# EAGLE design display_temp (EAGLE 5.02)
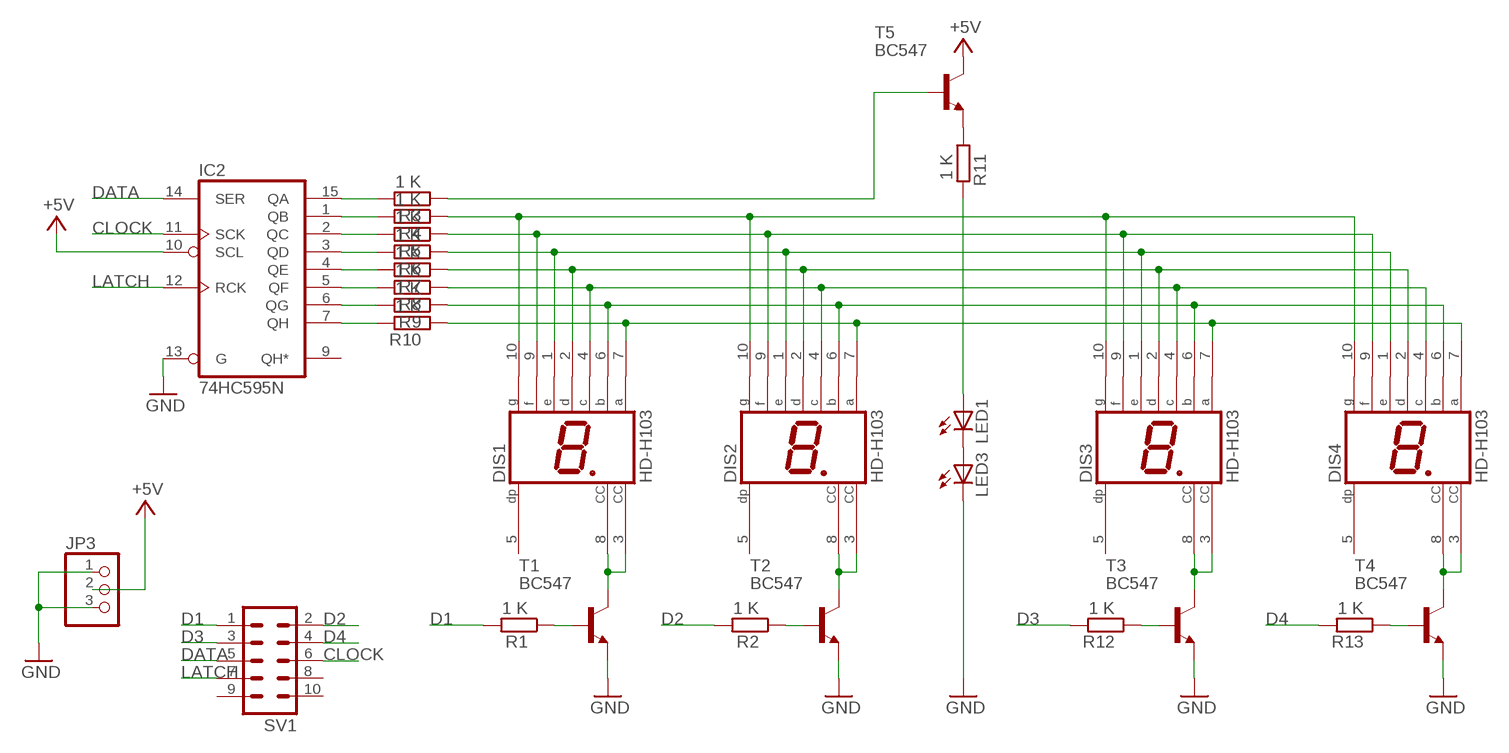
[diagram p0: schematic, sheet 1]

## Parts
DIS1  HD-H103  [HDSP-M]
DIS2  HD-H103  [HDSP-M]
DIS3  HD-H103  [HDSP-M]
DIS4  HD-H103  [HDSP-M]
IC2  74HC595N  [DIL16]
JP3  PINHD-1X3180  [1X03]
LED1  LED3MM  [LED3MM]
LED3  LED3MM  [LED3MM]
R1  1 K  R-EU_0207/10  [0207/10]
R2  1 K  R-EU_0207/10  [0207/10]
R3  1 K  R-EU_0207/10  [0207/10]
R4  1 K  R-EU_0207/10  [0207/10]
R5  1 K  R-EU_0207/10  [0207/10]
R6  1 K  R-EU_0207/10  [0207/10]
R7  1 K  R-EU_0207/10  [0207/10]
R8  1 K  R-EU_0207/10  [0207/10]
R9  1 K  R-EU_0207/10  [0207/10]
R10  1 K  R-EU_0207/10  [0207/10]
R11  1 K  R-EU_0207/10  [0207/10]
R12  1 K  R-EU_0207/10  [0207/10]
R13  1 K  R-EU_0207/10  [0207/10]
SV1  ML10  [ML10]
T1  BC547  [TO92]
T2  BC547  [TO92]
T3  BC547  [TO92]
T4  BC547  [TO92]
T5  BC547  [TO92]

## Nets
+5V: IC2.10(SCL) JP3.2 T5.3(C)
CLOCK: IC2.11(SCK) SV1.6
D1: R1.2 SV1.1
D2: R2.2 SV1.2
D3: R12.2 SV1.3
D4: R13.2 SV1.4
DATA: IC2.14(SER) SV1.5
GND: IC2.13(G) JP3.1 JP3.3 LED3.K(C) T1.1(E) T2.1(E) T3.1(E) T4.1(E)
LATCH: IC2.12(RCK) SV1.7
N$1: DIS1.3(CC) DIS1.8(CC) T1.3(C)
N$2: DIS1.9(F) DIS2.9(F) DIS3.9(F) DIS4.9(F) R5.1
N$3: R1.1 T1.2(B)
N$4: DIS1.1(E) DIS2.1(E) DIS3.1(E) DIS4.1(E) R6.1
N$5: DIS1.10(G) DIS2.10(G) DIS3.10(G) DIS4.10(G) R4.1
N$6: DIS1.4(C) DIS2.4(C) DIS3.4(C) DIS4.4(C) R8.1
N$7: DIS1.7(A) DIS2.7(A) DIS3.7(A) DIS4.7(A) R10.1
N$8: IC2.2(QC) R5.2
N$9: R3.1 T5.2(B)
N$10: DIS2.3(CC) DIS2.8(CC) T2.3(C)
N$11: R2.1 T2.2(B)
N$12: R11.1 T5.1(E)
N$13: LED1.A R11.2
N$14: DIS1.2(D) DIS2.2(D) DIS3.2(D) DIS4.2(D) R7.1
N$15: LED1.K(C) LED3.A
N$16: DIS3.3(CC) DIS3.8(CC) T3.3(C)
N$17: DIS1.6(B) DIS2.6(B) DIS3.6(B) DIS4.6(B) R9.1
N$18: R12.1 T3.2(B)
N$19: IC2.4(QE) R7.2
N$20: IC2.5(QF) R8.2
N$21: IC2.6(QG) R9.2
N$22: IC2.7(QH) R10.2
N$23: IC2.3(QD) R6.2
N$24: IC2.1(QB) R4.2
N$25: IC2.15(QA) R3.2
N$26: DIS4.3(CC) DIS4.8(CC) T4.3(C)
N$27: R13.1 T4.2(B)
Unconnected: DIS1.5(DP) DIS2.5(DP) DIS3.5(DP) DIS4.5(DP) IC2.9(QH*) SV1.8 SV1.9 SV1.10

## Power pins joined to a net without a drawn wire
GND: IC2.8(GND)
VCC: IC2.16(VCC)

## Library data of the parts
DIS1-DIS4 = display:HD-H103: LED DISPLAY 1-character 7 segment, decimal point right
IC2 = display:74*595: 8-bit SHIFT REGISTER, output latch
JP3 = display:PINHD-1X3: PIN HEADER
LED1 LED3 = display:LED: LED OSRAM: - CHIPLED LG R971, LG N971, LY N971, LG Q971, LY Q971, LO R971, LY R971 LH N974, LH R974 LS Q976, LO Q976, LY Q976 LO Q996 - Hyper CHIPLED LW Q18S LB Q993, LB Q99A, LB R99A - SideLED LS A670, LO A670, LY A670, LG A670, LP A670 LB A673, LV A673, LT A673, LW A673 LH A674 LY A675 LS A676, LA A676, LO A676, LY A676, LW A676 LS A679, LY A679, LG A679 - Hyper Micro SIDELED® LS Y876, LA Y876, LO Y876, LY Y876 LT Y87S - SmartLED LW L88C, LW L88S LB L89C, LB L89S, LG L890 LS L89K, LO L89K, LY L89K LS L896, LA L896, LO L896, LY L896 - TOPLED LS T670, LO T670, LY T670, LG T670, LP T670 LSG T670, LSP T670, LSY T670, LOP T670, LYG T670 LG T671, LOG T671, LSG T671 LB T673, LV T673, LT T673, LW T673 LH T674 LS T676, LA T676, LO T676, LY T676, LB T676, LH T676, LSB T676, LW T676 LB T67C, LV T67C, LT T67C, LS T67K, LO T67K, LY T67K, LW E67C LS E67B, LA E67B, LO E67B, LY E67B, LB E67C, LV E67C, LT E67C LW T67C LS T679, LY T679, LG T679 LS T770, LO T770, LY T770, LG T770, LP T770 LB T773, LV T773, LT T773, LW T773 LH T774 LS E675, LA E675, LY E675, LS T675 LS T776, LA T776, LO T776, LY T776, LB T776 LHGB T686 LT T68C, LB T68C - Hyper Mini TOPLED® LB M676 - Mini TOPLED Santana® LG M470 LS M47K, LO M47K, LY M47K Source: http://www.osram.convergy.de - LUMILED® LXK2-PW12-R00, LXK2-PW12-S00, LXK2-PW14-U00, LXK2-PW14-V00 LXK2-PM12-R00, LXK2-PM12-S00, LXK2-PM14-U00 LXK2-PE12-Q00, LXK2-PE12-R00, LXK2-PE12-S00, LXK2-PE14-T00, LXK2-PE14-U00 LXK2-PB12-K00, LXK2-PB12-L00, LXK2-PB12-M00, LXK2-PB14-N00, LXK2-PB14-P00, LXK2-PB14-Q00 LXK2-PR12-L00, LXK2-PR12-M00, LXK2-PR14-Q00, LXK2-PR14-R00 LXK2-PD12-Q00, LXK2-PD12-R00, LXK2-PD12-S00 LXK2-PH12-R00, LXK2-PH12-S00 LXK2-PL12-P00, LXK2-PL12-Q00, LXK2-PL12-R00 Source: www.luxeon.com
R1-R13 = display:R-EU_: RESISTOR, European symbol
SV1 = display:ML10: HARTING
T1-T5 = display:BC547: NPN TRANSISTOR

## Board
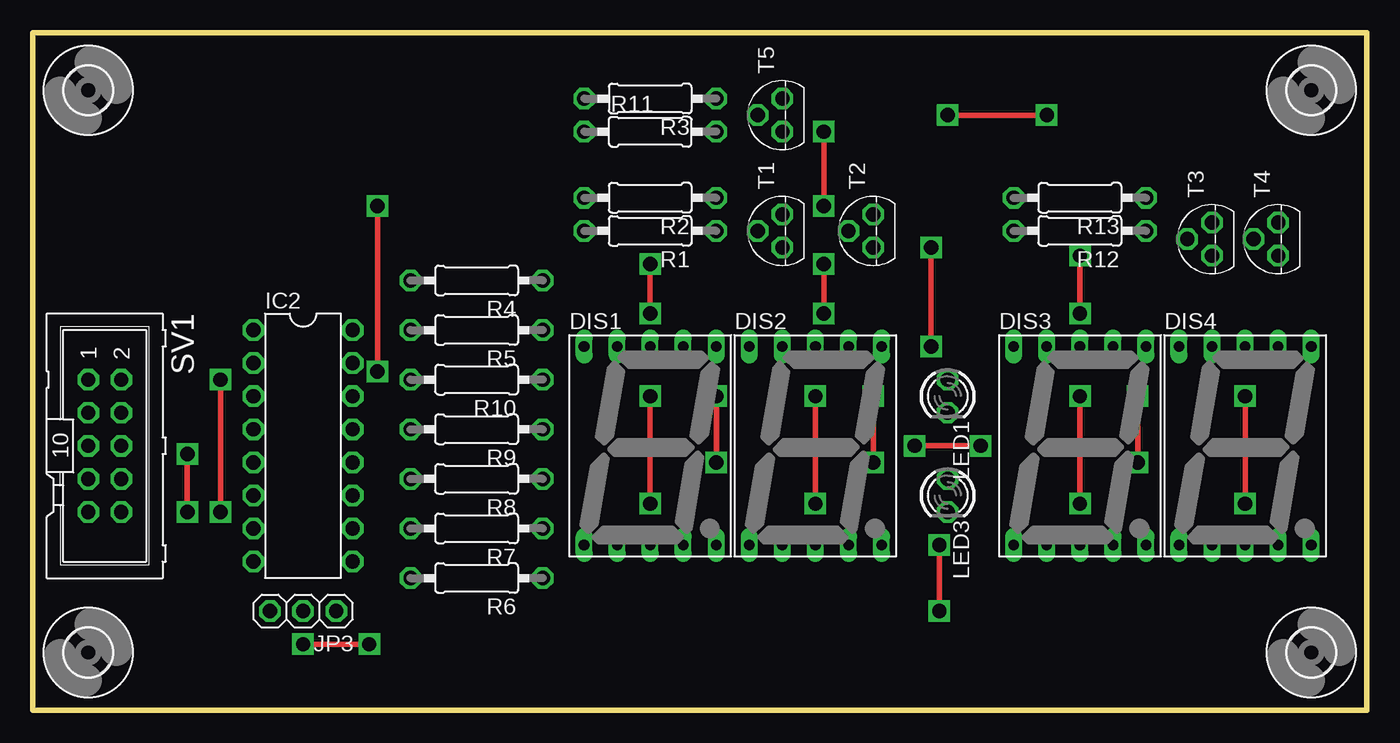
[diagram p1: board, top side]
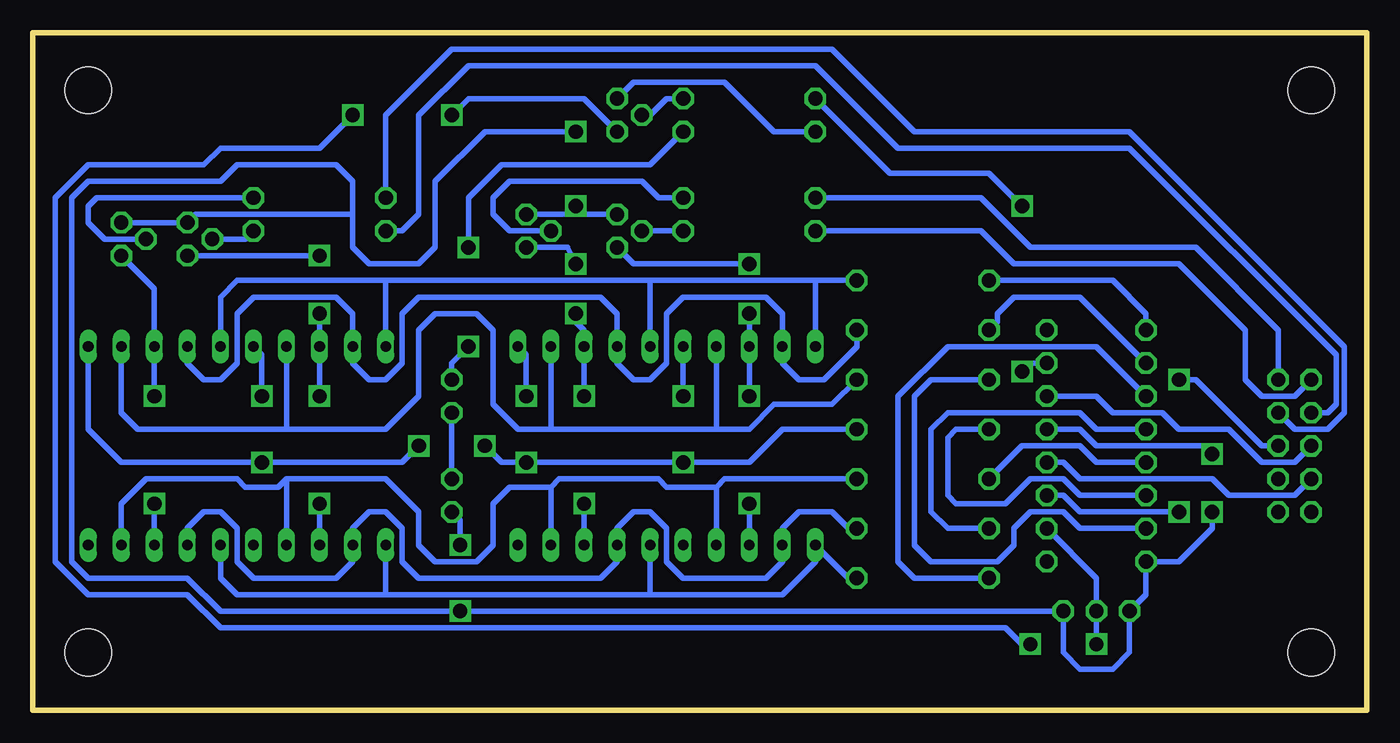
[diagram p2: board, bottom side, seen from below]

Size 102.54 x 52.06 mm. Coordinates in mm from the lower left corner, seen from the top.
Outline: 0,0 102.54,0 102.54,52.06 0,52.06 0,0
Copper layers (1*16): Top 0.035mm / dielectric 1.5mm / Bottom 0.035mm
Design rules "default": minimum track width 10mil, minimum drill 24mil, track to track 8mil, track to pad 8mil, pad to pad 8mil, via to via 8mil, smd to smd 8mil, copper to edge 40mil, drill to drill 8mil, minimum pad ring 10mil, minimum via ring 8mil, stop-mask expansion 4mil, vias tented up to drill 0mil, thermal gap 10mil

### Footprints (pad centres in the part's own frame; a part is rotated, then mirrored left to right if it is on the bottom)
HDSP-M = drill 0.813 long: 1 -5.08,-7.62; 2 -2.54,-7.62; 3 0,-7.62; 4 2.54,-7.62; 5 5.08,-7.62; 6 5.08,7.62; 7 2.54,7.62; 8 0,7.62; 9 -2.54,7.62; 10 -5.08,7.62
DIL16 = drill 1.1 octagon: 1 -8.89,-3.81; 2 -6.35,-3.81; 3 -3.81,-3.81; 4 -1.27,-3.81; 5 1.27,-3.81; 6 3.81,-3.81; 7 6.35,-3.81; 8 8.89,-3.81; 9 8.89,3.81; 10 6.35,3.81; 11 3.81,3.81; 12 1.27,3.81; 13 -1.27,3.81; 14 -3.81,3.81; 15 -6.35,3.81; 16 -8.89,3.81
1X03 = drill 1.1 octagon: 1 -2.54,0; 2 0,0; 3 2.54,0
LED3MM = drill 1.1 octagon: A -1.27,0; K 1.27,0
0207/10 = drill 1.1 octagon: 1 -5.08,0; 2 5.08,0
ML10 = drill 1.1 octagon: 1 -5.08,-1.27; 2 -5.08,1.27; 3 -2.54,-1.27; 4 -2.54,1.27; 5 0,-1.27; 6 0,1.27; 7 2.54,-1.27; 8 2.54,1.27; 9 5.08,-1.27; 10 5.08,1.27
TO92 = drill 1.1 octagon: 1 1.27,0; 2 0,1.905; 3 -1.27,0
3,6 = hole 3.6: 0,0

### Placement (x,y rotation side)
DIS1  47.46,20.31 0 top
DIS2  60.16,20.31 0 top
DIS3  80.48,20.31 0 top
DIS4  93.18,20.31 0 top
IC2  20.79,20.31 270 top
JP3  20.79,7.62 180 top
LED1  70.32,24.12 270 top
LED3  70.32,16.51 270 top
R1  47.46,36.83 180 top
R2  47.46,39.37 180 top
R3  47.46,46.98 180 top
R4  34.12,33.02 180 top
R5  34.12,29.2 180 top
R6  34.12,10.16 180 top
R7  34.12,13.97 180 top
R8  34.12,17.77 180 top
R9  34.12,21.59 180 top
R10  34.12,25.4 180 top
R11  47.46,44.45 0 top
R12  80.48,36.83 180 top
R13  80.48,39.37 180 top
SV1  5.55,20.31 270 top
T1  57.62,36.83 90 top
T2  64.6,36.83 90 top
T3  90.64,36.19 90 top
T4  95.72,36.19 90 top
T5  57.62,45.72 90 top
U$1  [3,6]  4.28,4.44 0 top
U$2  [3,6]  4.28,47.62 0 top
U$3  [3,6]  98.26,47.62 0 top
U$4  [3,6]  98.26,4.44 0 top

### Tracks (layer width: path | path; a pad name or v marks a point on that pad's centre or on a via)
+5V  (via drill 1.1)
  Top 0.406: v77.94,45.72 v70.32,45.72 | v20.79,5.08 v25.87,5.08
  Bottom 0.406: IC2.10 20.79,10.16 JP3.2 v20.79,5.08 | T5.3 60.16,46.98 69.05,46.98 v70.32,45.72 | v77.94,45.72 80.48,43.17 88.1,43.17 89.37,41.91 98.26,41.91 100.8,39.37 100.8,11.43 98.26,8.89 90.64,8.89 88.1,6.35 27.77,6.35 26.5,5.08 v25.87,5.08
CLOCK  (via drill 1.1)
  Top 0.406: v14.44,25.4 v14.44,15.23
  Bottom 0.406: IC2.11 23.33,16.51 22.06,15.23 v14.44,15.23 | v14.44,25.4 13.17,25.4 8.09,20.31 SV1.6
D1
  Bottom 0.406: SV1.1 5.55,24.12 8.09,24.12 9.36,25.4 9.36,29.2 14.44,34.29 27.14,34.29 29.68,36.83 R1.2
D2
  Bottom 0.406: SV1.2 6.82,29.2 13.17,35.55 25.87,35.55 29.68,39.37 R2.2
D3
  Bottom 0.406: R12.2 74.13,36.83 72.86,38.09 72.86,45.72 69.05,49.53 42.38,49.53 36.03,43.17 18.25,43.17 2.38,27.3 2.38,23.49 3.01,22.86 SV1.3
D4
  Bottom 0.406: SV1.4 5.55,21.59 3.01,21.59 1.74,22.86 1.74,27.94 18.25,44.45 34.76,44.45 41.11,50.8 70.32,50.8 75.4,45.72 R13.2
DATA
  Bottom 0.406: SV1.5 5.55,19.05 8.09,19.05 10.63,21.59 14.44,21.59 15.71,22.86 19.52,22.86 20.79,24.12 IC2.14
GND  (via drill 1.1)
  Top 0.406: v69.69,7.62 v69.69,12.7 | v11.9,15.23 v11.9,19.68 | v60.8,44.45 v60.8,38.73
  Bottom 0.406: T4.1 T3.1 90,38.09 77.94,38.09 | IC2.13 22.06,21.59 20.79,20.31 12.54,20.31 v11.9,19.68 | v11.9,15.23 11.9,13.97 14.44,11.43 IC2.8 16.98,8.89 JP3.3 18.25,4.44 19.52,3.17 22.06,3.17 23.33,4.44 JP3.1 v69.69,7.62 88.1,7.62 90.64,10.16 98.26,10.16 99.53,11.43 99.53,39.37 98.26,40.63 88.1,40.63 86.83,41.91 79.21,41.91 77.94,40.63 77.94,38.09 | 60.8,38.09 T1.1 | 60.8,38.09 T2.1 | v60.8,44.45 67.78,44.45 71.59,40.63 71.59,35.55 72.86,34.29 76.67,34.29 77.94,35.55 77.94,38.09 | v60.8,38.73 60.8,38.09 | v69.69,12.7 69.69,14.6 LED3.K
LATCH
  Bottom 0.406: IC2.12 23.33,19.05 22.06,17.77 11.9,17.77 10.63,16.51 5.55,16.51 SV1.7
N$1  (via drill 1.1)
  Top 0.406: v47.46,15.87 v47.46,24.12 | v47.46,30.48 v47.46,34.29
  Bottom 0.406: DIS1.3 v47.46,15.87 | v47.46,24.12 DIS1.8 v47.46,30.48 | T1.3 56.35,34.29 v47.46,34.29
N$2
  Bottom 0.406: DIS4.9 90.64,26.66 89.37,25.4 88.1,25.4 86.83,26.66 86.83,30.48 85.56,31.75 79.21,31.75 77.94,30.48 DIS3.9 77.94,26.66 76.67,25.4 75.4,25.4 74.13,26.66 74.13,30.48 72.86,31.75 58.89,31.75 57.62,30.48 DIS2.9 57.62,26.66 56.35,25.4 55.08,25.4 53.81,26.66 53.81,30.48 52.54,31.75 46.19,31.75 44.92,30.48 DIS1.9 44.92,26.66 43.65,25.4 41.75,25.4 39.2,27.94 R5.1
N$3
  Bottom 0.406: R1.1 T1.2
N$4
  Bottom 0.406: 55.08,10.16 DIS2.1 55.08,8.89 | 55.08,8.89 75.4,8.89 | 75.4,8.89 DIS3.1 | 55.08,8.89 44.92,8.89 42.38,11.43 DIS1.1 39.84,10.16 R6.1 | 75.4,8.89 86.83,8.89 88.1,10.16 DIS4.1
N$5
  Bottom 0.406: 55.08,30.48 DIS2.10 55.08,33.02 | 55.08,33.02 75.4,33.02 | 75.4,33.02 DIS3.10 | 75.4,33.02 86.83,33.02 88.1,31.75 DIS4.10 | 42.38,33.02 R4.1 | DIS1.10 42.38,33.02 | 42.38,33.02 55.08,33.02
N$6
  Bottom 0.406: 83.02,17.77 DIS3.4 | DIS4.4 95.72,15.87 93.81,17.77 86.83,17.77 86.19,17.14 83.66,17.14 83.02,17.77 | 62.7,17.14 DIS2.4 | 50,17.14 DIS1.4 | 47.46,17.77 49.36,17.77 50,17.14 | 47.46,17.77 46.83,17.77 | 62.7,17.14 62.06,17.77 54.44,17.77 53.81,17.14 50,17.14 | 83.02,17.77 75.4,17.77 72.86,15.23 72.86,12.7 71.59,11.43 68.41,11.43 67.14,12.7 67.14,15.87 65.88,17.14 62.7,17.14 | R8.1 47.46,17.77
N$7
  Bottom 0.406: 50,21.59 DIS1.7 | 50,21.59 62.7,21.59 | 62.7,21.59 DIS2.7 | 83.02,21.59 DIS3.7 | 50,21.59 47.46,21.59 45.56,23.49 41.11,23.49 R10.1 | 62.7,21.59 65.24,21.59 67.14,23.49 67.14,29.2 68.41,30.48 71.59,30.48 72.86,29.2 72.86,24.12 75.4,21.59 83.02,21.59 | 83.02,21.59 94.45,21.59 95.72,22.86 DIS4.7
N$8
  Bottom 0.406: IC2.2 22.06,31.75 27.14,31.75 28.41,30.48 28.41,29.84 R5.2
N$9
  Bottom 0.406: T5.2 55.08,45.72 53.81,46.98 R3.1
N$10  (via drill 1.1)
  Top 0.406: v60.16,15.87 v60.16,24.12 | v60.8,30.48 v60.8,34.29
  Bottom 0.406: DIS2.3 v60.16,15.87 | v60.16,24.12 DIS2.8 60.16,29.2 61.43,30.48 v60.8,30.48 | T2.3 61.43,35.55 v60.8,34.29
N$11
  Bottom 0.406: R2.1 54.44,39.37 55.72,40.63 65.88,40.63 67.14,39.37 67.14,38.09 65.88,36.83 T2.2
N$12
  Bottom 0.406: R11.1 45.56,44.45 49.36,48.25 56.35,48.25 T5.1
N$13  (via drill 1.1)
  Top 0.406: v69.05,27.94 v69.05,35.55
  Bottom 0.406: LED1.A 70.32,26.66 v69.05,27.94 | v69.05,35.55 69.05,39.37 66.51,41.91 55.08,41.91 R11.2
N$14
  Bottom 0.406: DIS4.2 90.64,13.97 89.37,15.23 88.1,15.23 86.83,13.97 86.83,11.43 85.56,10.16 79.21,10.16 77.94,11.43 DIS3.2 77.94,13.97 76.67,15.23 75.4,15.23 74.13,13.97 74.13,11.43 72.86,10.16 58.89,10.16 57.62,11.43 DIS2.2 57.62,13.97 56.35,15.23 55.08,15.23 53.81,13.97 53.81,11.43 52.54,10.16 46.19,10.16 44.92,11.43 DIS1.2 44.92,13.97 43.65,15.23 41.11,15.23 39.84,13.97 R7.1
N$15
  Bottom 0.406: LED3.A LED1.K
N$16  (via drill 1.1)
  Top 0.406: v80.48,15.87 v80.48,24.12 | v80.48,30.48 v80.48,34.92
  Bottom 0.406: DIS3.3 v80.48,15.87 | v80.48,24.12 DIS3.8 v80.48,30.48 | v80.48,34.92 T3.3
N$17  (via drill 1.1)
  Top 0.406: v67.78,20.31 v72.86,20.31 | v52.54,19.05 v52.54,24.12 v52.54,19.05 | v64.6,19.05 v64.6,24.12 v64.6,19.05 | v84.92,19.05 v84.92,24.12 v84.92,19.05
  Bottom 0.406: R9.1 44.92,21.59 47.46,19.05 v52.54,19.05 v64.6,19.05 66.51,19.05 v67.78,20.31 | DIS2.6 64.6,27.3 v64.6,24.12 | v72.86,20.31 74.13,19.05 v84.92,19.05 95.72,19.05 98.26,21.59 DIS4.6 | DIS3.6 84.92,27.3 v84.92,24.12 | v52.54,24.12 DIS1.6 v52.54,24.12
N$18
  Bottom 0.406: R12.1 86.19,36.19 T3.2
N$19
  Bottom 0.406: IC2.4 20.79,21.59 22.06,22.86 32.22,22.86 33.49,21.59 33.49,15.23 32.22,13.97 R7.2
N$20
  Bottom 0.406: IC2.5 20.79,19.05 22.06,20.31 26.5,20.31 R8.2
N$21
  Bottom 0.406: IC2.6 22.06,16.51 23.33,17.77 25.87,17.77 27.77,15.87 31.58,15.87 32.22,16.51 32.22,20.95 31.58,21.59 R9.2
N$22
  Bottom 0.406: IC2.7 22.06,13.97 23.33,15.23 25.87,15.23 27.14,13.97 27.14,12.7 28.41,11.43 33.49,11.43 34.76,12.7 34.76,24.12 33.49,25.4 R10.2
N$23
  Bottom 0.406: R6.2 34.76,10.16 36.03,11.43 36.03,24.12 32.22,27.94 20.79,27.94 IC2.3
N$24
  Bottom 0.406: IC2.1 16.98,30.48 19.52,33.02 R4.2
N$25  (via drill 1.1)
  Top 0.406: v26.5,26.03 v26.5,38.73
  Bottom 0.406: R3.2 36.67,41.27 29.04,41.27 v26.5,38.73 | IC2.15 25.87,26.66 v26.5,26.03
N$26  (via drill 1.1)
  Top 0.406: v93.18,15.87 v93.18,24.12
  Bottom 0.406: DIS4.3 v93.18,15.87 | v93.18,24.12 DIS4.8 93.18,32.38 T4.3
N$27
  Bottom 0.406: T4.2 96.99,36.19 98.26,37.46 98.26,38.73 97.62,39.37 R13.1